# EAGLE schematic March12 (EAGLE 8.7.0)
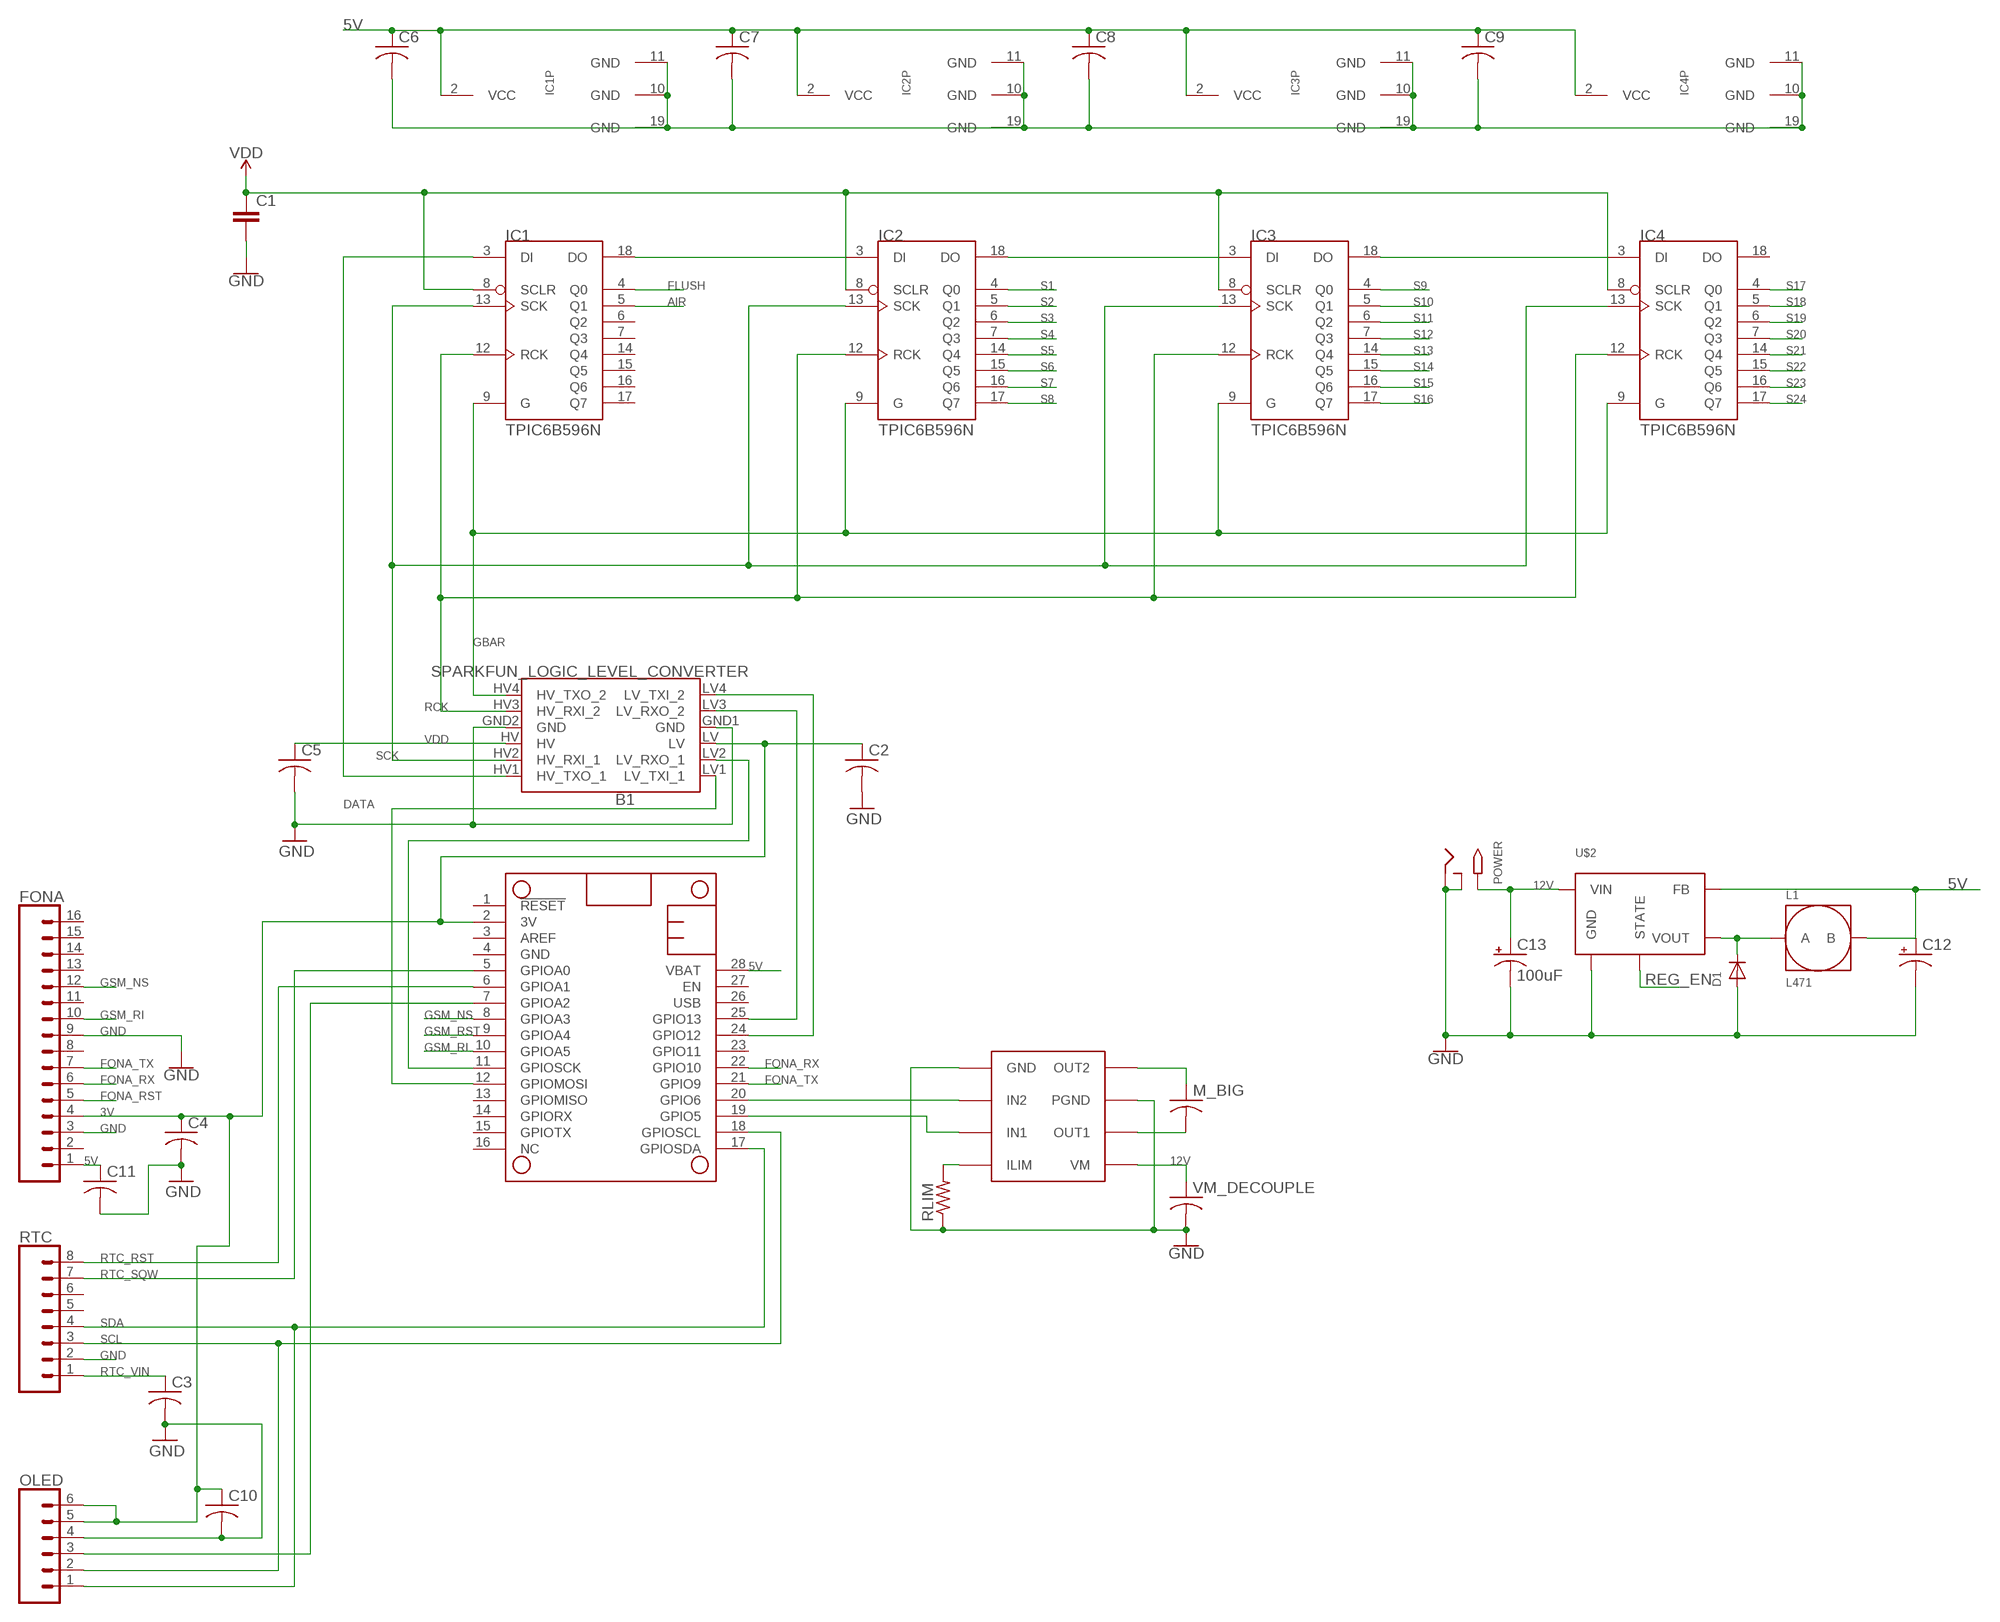
[diagram p0: schematic, sheet 1]

## Parts
B1  SPARKFUN_LOGIC_LEVEL_CONVERTER  [SPARKFUN_LOGIC_LEVEL_CONVERTER]
C1  C2.5/5  [C2.5-5]
C2  C-US025-025X050  [C025-025X050]
C3  C-US025-025X050  [C025-025X050]
C4  C-US025-025X050  [C025-025X050]
C5  C-US025-025X050  [C025-025X050]
C6  C-US025-025X050  [C025-025X050]
C7  C-US025-025X050  [C025-025X050]
C8  C-US025-025X050  [C025-025X050]
C9  C-US025-025X050  [C025-025X050]
C10  C-US025-025X050  [C025-025X050]
C11  C-US025-025X050  [C025-025X050]
C12  CPOL-US140CLH-0810  [140CLH-0810]
C13  100uF  100UF-POLAR-10X10.5-63V-20%  [NIC_10X10.5_CAP]
D1  DIODESOD-123  [SOD-123]
FONA  CONN_16  [1X16]
IC1  TPIC6B596N  [DIL20]
IC2  TPIC6B596N  [DIL20]
IC3  TPIC6B596N  [DIL20]
IC4  TPIC6B596N  [DIL20]
L1  L471  [12-12]
M_BIG  C-US025-025X050  [C025-025X050]
MS1  FEATHERWING  [FEATHERWING]
OLED  CONN_06SILK_FEMALE_PTH  [1X06]
POWER  2.1MMJACKSMT  [DCJACK_2MM_SMT]
RLIM  R-US_0204/7  [0204/7]
RTC  CONN_08"  [1X08]
U$1  DRV8871  [DRV8871]
U$2  LM2575  [TO-263]
VM_DECOUPLE  C-US025-025X050  [C025-025X050]

## Nets
3V: B1.LV C2.1 C4.1 C10.1 FONA.4 MS1.2(3V) OLED.5 OLED.6
5V: C6.1 C7.1 C8.1 C9.1 C11.1 C12.+ FONA.1 IC1.2(VCC) IC2.2(VCC) IC3.2(VCC) IC4.2(VCC) L1.B MS1.28(VBAT) U$2.FB
12V: C13.+ POWER.PWR2(TIP) U$1.VM U$2.VIN VM_DECOUPLE.1
AIR: IC1.5(Q1)
DATA: B1.HV1(HV_TXO_1) IC1.3(DI)
FLUSH: IC1.4(Q0)
FONA_RST: FONA.5
FONA_RX: FONA.6 MS1.22(GPIO10)
FONA_TX: FONA.7 MS1.21(GPIO9)
GBAR: B1.HV4(HV_TXO_2) IC1.9(G) IC2.9(G) IC3.9(G) IC4.9(G)
GND: B1.GND1(GND) B1.GND2(GND) C1.2 C2.2 C3.2 C4.2 C5.2 C10.2 C11.2 C12.- C13.- D1.A FONA.3 FONA.9 OLED.4 POWER.GND(RING) POWER.GNDBREAK(RING_SW) RLIM.1 RTC.2 U$1.GND U$1.PGND U$2.GND VM_DECOUPLE.2
GSM_NS: FONA.12 MS1.8(GPIOA3)
GSM_RI: FONA.10 MS1.10(GPIOA5)
GSM_RST: MS1.9(GPIOA4)
N$1: B1.LV1(LV_TXI_1) MS1.12(GPIOMOSI)
N$2: IC1.18(DO) IC2.3(DI)
N$3: IC2.18(DO) IC3.3(DI)
N$4: B1.LV4(LV_TXI_2) MS1.24(GPIO12)
N$5: IC3.18(DO) IC4.3(DI)
N$6: B1.LV3(LV_RXO_2) MS1.25(GPIO13)
N$7: C6.2 C7.2 C8.2 C9.2 IC1.10(GND) IC1.11(GND) IC1.19(GND) IC2.10(GND) IC2.11(GND) IC2.19(GND) IC3.10(GND) IC3.11(GND) IC3.19(GND) IC4.10(GND) IC4.11(GND) IC4.19(GND)
N$8: D1.C L1.A U$2.VOUT
N$10: MS1.20(GPIO6) U$1.IN2
N$11: MS1.19(GPIO5) U$1.IN1
N$12: RLIM.2 U$1.ILIM
N$14: M_BIG.2 U$1.OUT1
N$16: M_BIG.1 U$1.OUT2
N$17: MS1.7(GPIOA2) OLED.3
N$39: B1.LV2(LV_RXO_1) MS1.11(GPIOSCK)
RCK: B1.HV3(HV_RXI_2) IC1.12(RCK) IC2.12(RCK) IC3.12(RCK) IC4.12(RCK)
REG_EN: U$2.STATE
RTC_RST: MS1.6(GPIOA1) RTC.8
RTC_SQW: MS1.5(GPIOA0) RTC.7
RTC_VIN: C3.1 RTC.1
S1: IC2.4(Q0)
S2: IC2.5(Q1)
S3: IC2.6(Q2)
S4: IC2.7(Q3)
S5: IC2.14(Q4)
S6: IC2.15(Q5)
S7: IC2.16(Q6)
S8: IC2.17(Q7)
S9: IC3.4(Q0)
S10: IC3.5(Q1)
S11: IC3.6(Q2)
S12: IC3.7(Q3)
S13: IC3.14(Q4)
S14: IC3.15(Q5)
S15: IC3.16(Q6)
S16: IC3.17(Q7)
S17: IC4.4(Q0)
S18: IC4.5(Q1)
S19: IC4.6(Q2)
S20: IC4.7(Q3)
S21: IC4.14(Q4)
S22: IC4.15(Q5)
S23: IC4.16(Q6)
S24: IC4.17(Q7)
SCK: B1.HV2(HV_RXI_1) IC1.13(SCK) IC2.13(SCK) IC3.13(SCK) IC4.13(SCK)
SCL: MS1.18(GPIOSCL) OLED.2 RTC.3
SDA: MS1.17(GPIOSDA) OLED.1 RTC.4
VDD: B1.HV C1.1 C5.1 IC1.8(SCLR) IC2.8(SCLR) IC3.8(SCLR) IC4.8(SCLR)
Unconnected: FONA.2 FONA.8 FONA.11 FONA.13 FONA.14 FONA.15 FONA.16 IC1.6(Q2) IC1.7(Q3) IC1.14(Q4) IC1.15(Q5) IC1.16(Q6) IC1.17(Q7) IC4.18(DO) MS1.1(!RESET) MS1.3(AREF) MS1.13(GPIOMISO) MS1.14(GPIORX) MS1.15(GPIOTX) MS1.16(NC) MS1.23(GPIO11) MS1.26(USB) MS1.27(EN) RTC.5 RTC.6

## Power pins joined to a net without a drawn wire
GND: MS1.4(GND)

## Library data of the parts
B1 = SparkFun-Boards:SPARKFUN_LOGIC_LEVEL_CONVERTER: SparkFun Logic Level Converter -Bi-Directional This is the mechnical outline for the 3.3V - 5V bi directional logic level converter. *Note, the "LOCK" Package has the header pins staggered by an offset of 5 mils (off center line), so that when you slide a row of standard 0.1" headers into the PTH pads, it will hold position vertically. See the follwing turorial for more information on this type of special footprints: Sneaky Footprints <https://www.sparkfun.com/tutorials/114> SparkFun Products: SparkFun Logic Level Converter - Bi-Directional <https://www.sparkfun.com/products/12009>
C1 = capacitor-wima:C: CAPACITOR naming: grid - package width
C2 C10 M_BIG VM_DECOUPLE = adafruit:C-US: CAPACITOR, American symbol
C3-C9 C11 = rcl:C-US: CAPACITOR, American symbol
C12 = rcl:CPOL-US: POLARIZED CAPACITOR, American symbol
C13 = SparkFun-Capacitors:100UF-POLAR: 100µF polarized capacitors A capacitor is a passive two-terminal electrical component used to store electrical energy temporarily in an electric field.; PROD_ID: CAP-08362
D1 = adafruit:DIODE: Diode SMADIODE - SMA Surface Mount Package 20V 1A Schottky Diode Digikey: 641-1014-6-ND DO-1N4148 - Through Hole Small Current Diode SOD-123 20V 1 A (.5mV Vf) Schottky Diode - Digikey: MBRX120TPMSCT-ND SOD-323 10V 570mA (.38mV Vf, 3ns) Schottky Diode - Digikey: ZLLS410CT-ND SOD-523 30V 30mA Schottky Diode (RB751S-40TE61) - Digikey: RB751S-40TE61CT-ND SOT23-R/W - SOT23 Package (R = Solder Paste/Reflow Ovens, W = Hand-Soldering) BAT54Film 40V 300mA - Digikey: 497-7162-1-ND
FONA = SparkFun-Connectors:CONN_16: Multi connection point. Often used as Generic Header-pin footprint for 0.1 inch spaced/style header connections On any of the 0.1 inch spaced packages, you can populate with these: Break Away Headers - Straight <https://www.sparkfun.com/products/116> (PRT-00116) Break Away Male Headers - Right Angle <https://www.sparkfun.com/products/553> (PRT-00553) Female Headers <https://www.sparkfun.com/products/115> (PRT-00115) Break Away Headers - Machine Pin <https://www.sparkfun.com/products/117> (PRT-00117) Break Away Female Headers - Swiss Machine Pin <https://www.sparkfun.com/products/743> (PRT-00743) For SCREWTERMINALS and SPRING TERMINALS visit here: Screw Terimnals on SparkFun.com <https://www.sparkfun.com/search/results?term=Screw+Terminals> (5mm/3.5mm/2.54mm spacing) This device is also useful as a general connection point to wire up your design to another part of your project. Our various solder wires solder well into these plated through hole pads. Hook-Up Wire - Assortment (Stranded, 22 AWG) <https://www.sparkfun.com/products/11375> (PRT-11375) Hook-Up Wire - Assortment (Solid Core, 22 AWG) <https://www.sparkfun.com/products/11367> (PRT-11367) View the entire wire category on our website here <https://www.sparkfun.com/categories/141> Special notes: Molex polarized connector foot print use with SKU : PRT-08231 with associated crimp pins and housings. 1MM SMD Version SKU: PRT-10208 NOTES ON THE VARIANTS LOCK and LOCK_LONGPADS... This footprint was designed to help hold the alignment of a through-hole component (i.e. 6-pin header) while soldering it into place. You may notice that each hole has been shifted either up or down by 0.005 of an inch from it's more standard position (which is a perfectly straight line). This slight alteration caused the pins (the squares in the middle) to touch the edges of the holes. Because they are alternating, it causes a "brace" to hold the component in place. 0.005 has proven to be the perfect amount of "off-center" position when using our standard breakaway headers. Although looks a little odd when you look at the bare footprint, once you have a header in there, the alteration is very hard to notice. Also,if you push a header all the way into place, it is covered up entirely on the bottom side.
IC1-IC4 = tpic:TPIC6B596
L1 = LM2575:L471
MS1 = adafruit:FEATHERWING
OLED = SparkFun-Connectors:CONN_06: Multi connection point. Often used as Generic Header-pin footprint for 0.1 inch spaced/style header connections On any of the 0.1 inch spaced packages, you can populate with these: Break Away Headers - Straight <https://www.sparkfun.com/products/116> (PRT-00116) Break Away Male Headers - Right Angle <https://www.sparkfun.com/products/553> (PRT-00553) Female Headers <https://www.sparkfun.com/products/115> (PRT-00115) Break Away Headers - Machine Pin <https://www.sparkfun.com/products/117> (PRT-00117) Break Away Female Headers - Swiss Machine Pin <https://www.sparkfun.com/products/743> (PRT-00743) Arduino Stackable Header - 6 Pin <https://www.sparkfun.com/products/9280> (PRT-09280) For SCREWTERMINALS and SPRING TERMINALS visit here: Screw Terimnals on SparkFun.com <https://www.sparkfun.com/search/results?term=Screw+Terminals> (5mm/3.5mm/2.54mm spacing) This device is also useful as a general connection point to wire up your design to another part of your project. Our various solder wires solder well into these plated through hole pads. Hook-Up Wire - Assortment (Stranded, 22 AWG) <https://www.sparkfun.com/products/11375> (PRT-11375) Hook-Up Wire - Assortment (Solid Core, 22 AWG) <https://www.sparkfun.com/products/11367> (PRT-11367) View the entire wire category on our website here <https://www.sparkfun.com/categories/141>; PROD_ID: CONN-08437
POWER = adafruit:2.1MMJACK: 2.1mm x 5.5mm THM DC jack with internal switch. Digikey part #PJ-102A, 4UCON part #05537 2.1mm x 5.5mm SMT DC jack with internal switch. Digikey part #PJ-002A-SMT, 4UCON part #03267 By microbuilder.eu & adafruit.com
RLIM = adafruit:R-US_: RESISTOR, American symbol
RTC = SparkFun-Connectors:CONN_08: Multi connection point. Often used as Generic Header-pin footprint for 0.1 inch spaced/style header connections On any of the 0.1 inch spaced packages, you can populate with these: Break Away Headers - Straight <https://www.sparkfun.com/products/116> (PRT-00116) Break Away Male Headers - Right Angle <https://www.sparkfun.com/products/553> (PRT-00553) Female Headers <https://www.sparkfun.com/products/115> (PRT-00115) Break Away Headers - Machine Pin <https://www.sparkfun.com/products/117> (PRT-00117) Break Away Female Headers - Swiss Machine Pin <https://www.sparkfun.com/products/743> (PRT-00743) Arduino Stackable Header - 8 Pin <https://www.sparkfun.com/products/9279> (PRT-09279) For SCREWTERMINALS and SPRING TERMINALS visit here: Screw Terimnals on SparkFun.com <https://www.sparkfun.com/search/results?term=Screw+Terminals> (5mm/3.5mm/2.54mm spacing) This device is also useful as a general connection point to wire up your design to another part of your project. Our various solder wires solder well into these plated through hole pads. Hook-Up Wire - Assortment (Stranded, 22 AWG) <https://www.sparkfun.com/products/11375> (PRT-11375) Hook-Up Wire - Assortment (Solid Core, 22 AWG) <https://www.sparkfun.com/products/11367> (PRT-11367) View the entire wire category on our website here <https://www.sparkfun.com/categories/141> Special notes: Molex polarized connector foot print use with SKU : PRT-08231 with associated crimp pins and housings. 1MM SMD Version SKU: PRT-10208 NOTES ON THE VARIANTS LOCK and LOCK_LONGPADS... This footprint was designed to help hold the alignment of a through-hole component (i.e. 6-pin header) while soldering it into place. You may notice that each hole has been shifted either up or down by 0.005 of an inch from it's more standard position (which is a perfectly straight line). This slight alteration caused the pins (the squares in the middle) to touch the edges of the holes. Because they are alternating, it causes a "brace" to hold the component in place. 0.005 has proven to be the perfect amount of "off-center" position when using our standard breakaway headers. Although looks a little odd when you look at the bare footprint, once you have a header in there, the alteration is very hard to notice. Also,if you push a header all the way into place, it is covered up entirely on the bottom side.; PROD_ID: CONN-08438
U$1 = DRV8871:DRV8871
U$2 = LM2575:LM2575